# Altium schematic sheet SD_Card_Socket.SchDoc: SD Card Socket
size A4; DocumentNumber: 11; SheetNumber: 11; SheetTotal: 12
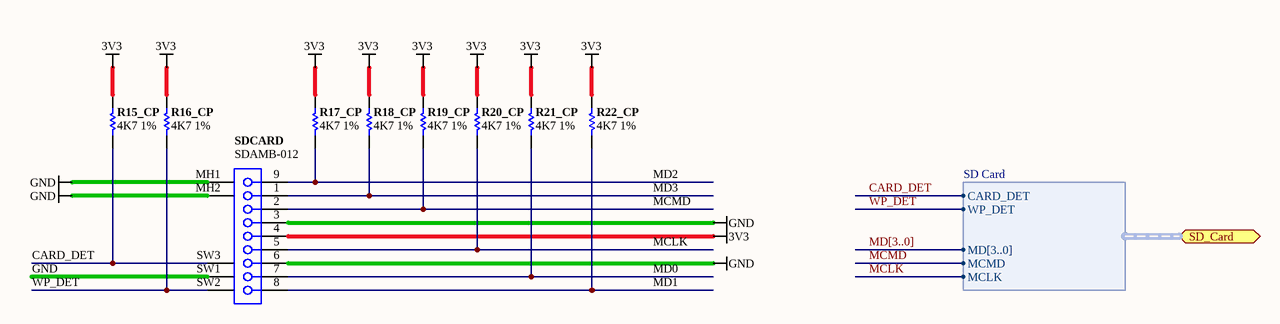
[diagram p0: SD_Card_Socket.SchDoc]

## Parts
R15_CP  4K7 1%  [RESC1005-STAR]
R16_CP  4K7 1%  [RESC1005-STAR]
R17_CP  4K7 1%  [RESC1005-STAR]
R18_CP  4K7 1%  [RESC1005-STAR]
R19_CP  4K7 1%  [RESC1005-STAR]
R20_CP  4K7 1%  [RESC1005-STAR]
R21_CP  4K7 1%  [RESC1005-STAR]
R22_CP  4K7 1%  [RESC1005-STAR]
SDCARD  SDAMB-012  [SDAMB-012]

## Ports
SD_Card (harness SD Card)

## Harnesses
SD Card: CARD_DET, WP_DET, MD[3..0], MCLK, MCMD

## Nets
3V3: R15_CP.2 R16_CP.2 R17_CP.2 R18_CP.2 R19_CP.2 R20_CP.2 R21_CP.2 R22_CP.2 SDCARD.4
GND: SDCARD.3 SDCARD.6 SDCARD.MH1 SDCARD.MH2 SDCARD.SW1
CARD_DET: R15_CP.1 SDCARD.SW3 ; port SD_Card.CARD_DET
MCLK: R20_CP.1 SDCARD.5 ; port SD_Card.MCLK
MCMD: R19_CP.1 SDCARD.2 ; port SD_Card.MCMD
MD0: R21_CP.1 SDCARD.7
MD1: R22_CP.1 SDCARD.8
MD2: R17_CP.1 SDCARD.9
MD3: R18_CP.1 SDCARD.1
WP_DET: R16_CP.1 SDCARD.SW2 ; port SD_Card.WP_DET

## Buses and harness runs
bus MD[3..0]

## Notes on the sheet
- Sheet Title
- Project Title
- Size:
- Date:
- A4
- Assy:
- Time:
- Revision:
- Sheet
- of
- File:

## Library data of the parts
R15_CP R16_CP R17_CP R18_CP R19_CP R20_CP R21_CP R22_CP = D-100-0088: Resistor, 4K7 1% 0402 (1005); Power Rating: 63 mW; Resistance: 4.7 K; Category: Resistor; Mounting Technology: Surface Mount; Status: Production; Tolerance: 1 %
SDCARD = D-300-0018: SDCARD Connector SDAMB-012; Connector type: Straight; Max Current: mA; Mounting Technology: Surface Mount; Status: Unreleased; Category: Connector